# Altium schematic sheet MB_drivers.SchDoc
size 594 x 420 mm; SheetNumber: 7; SheetTotal: 8
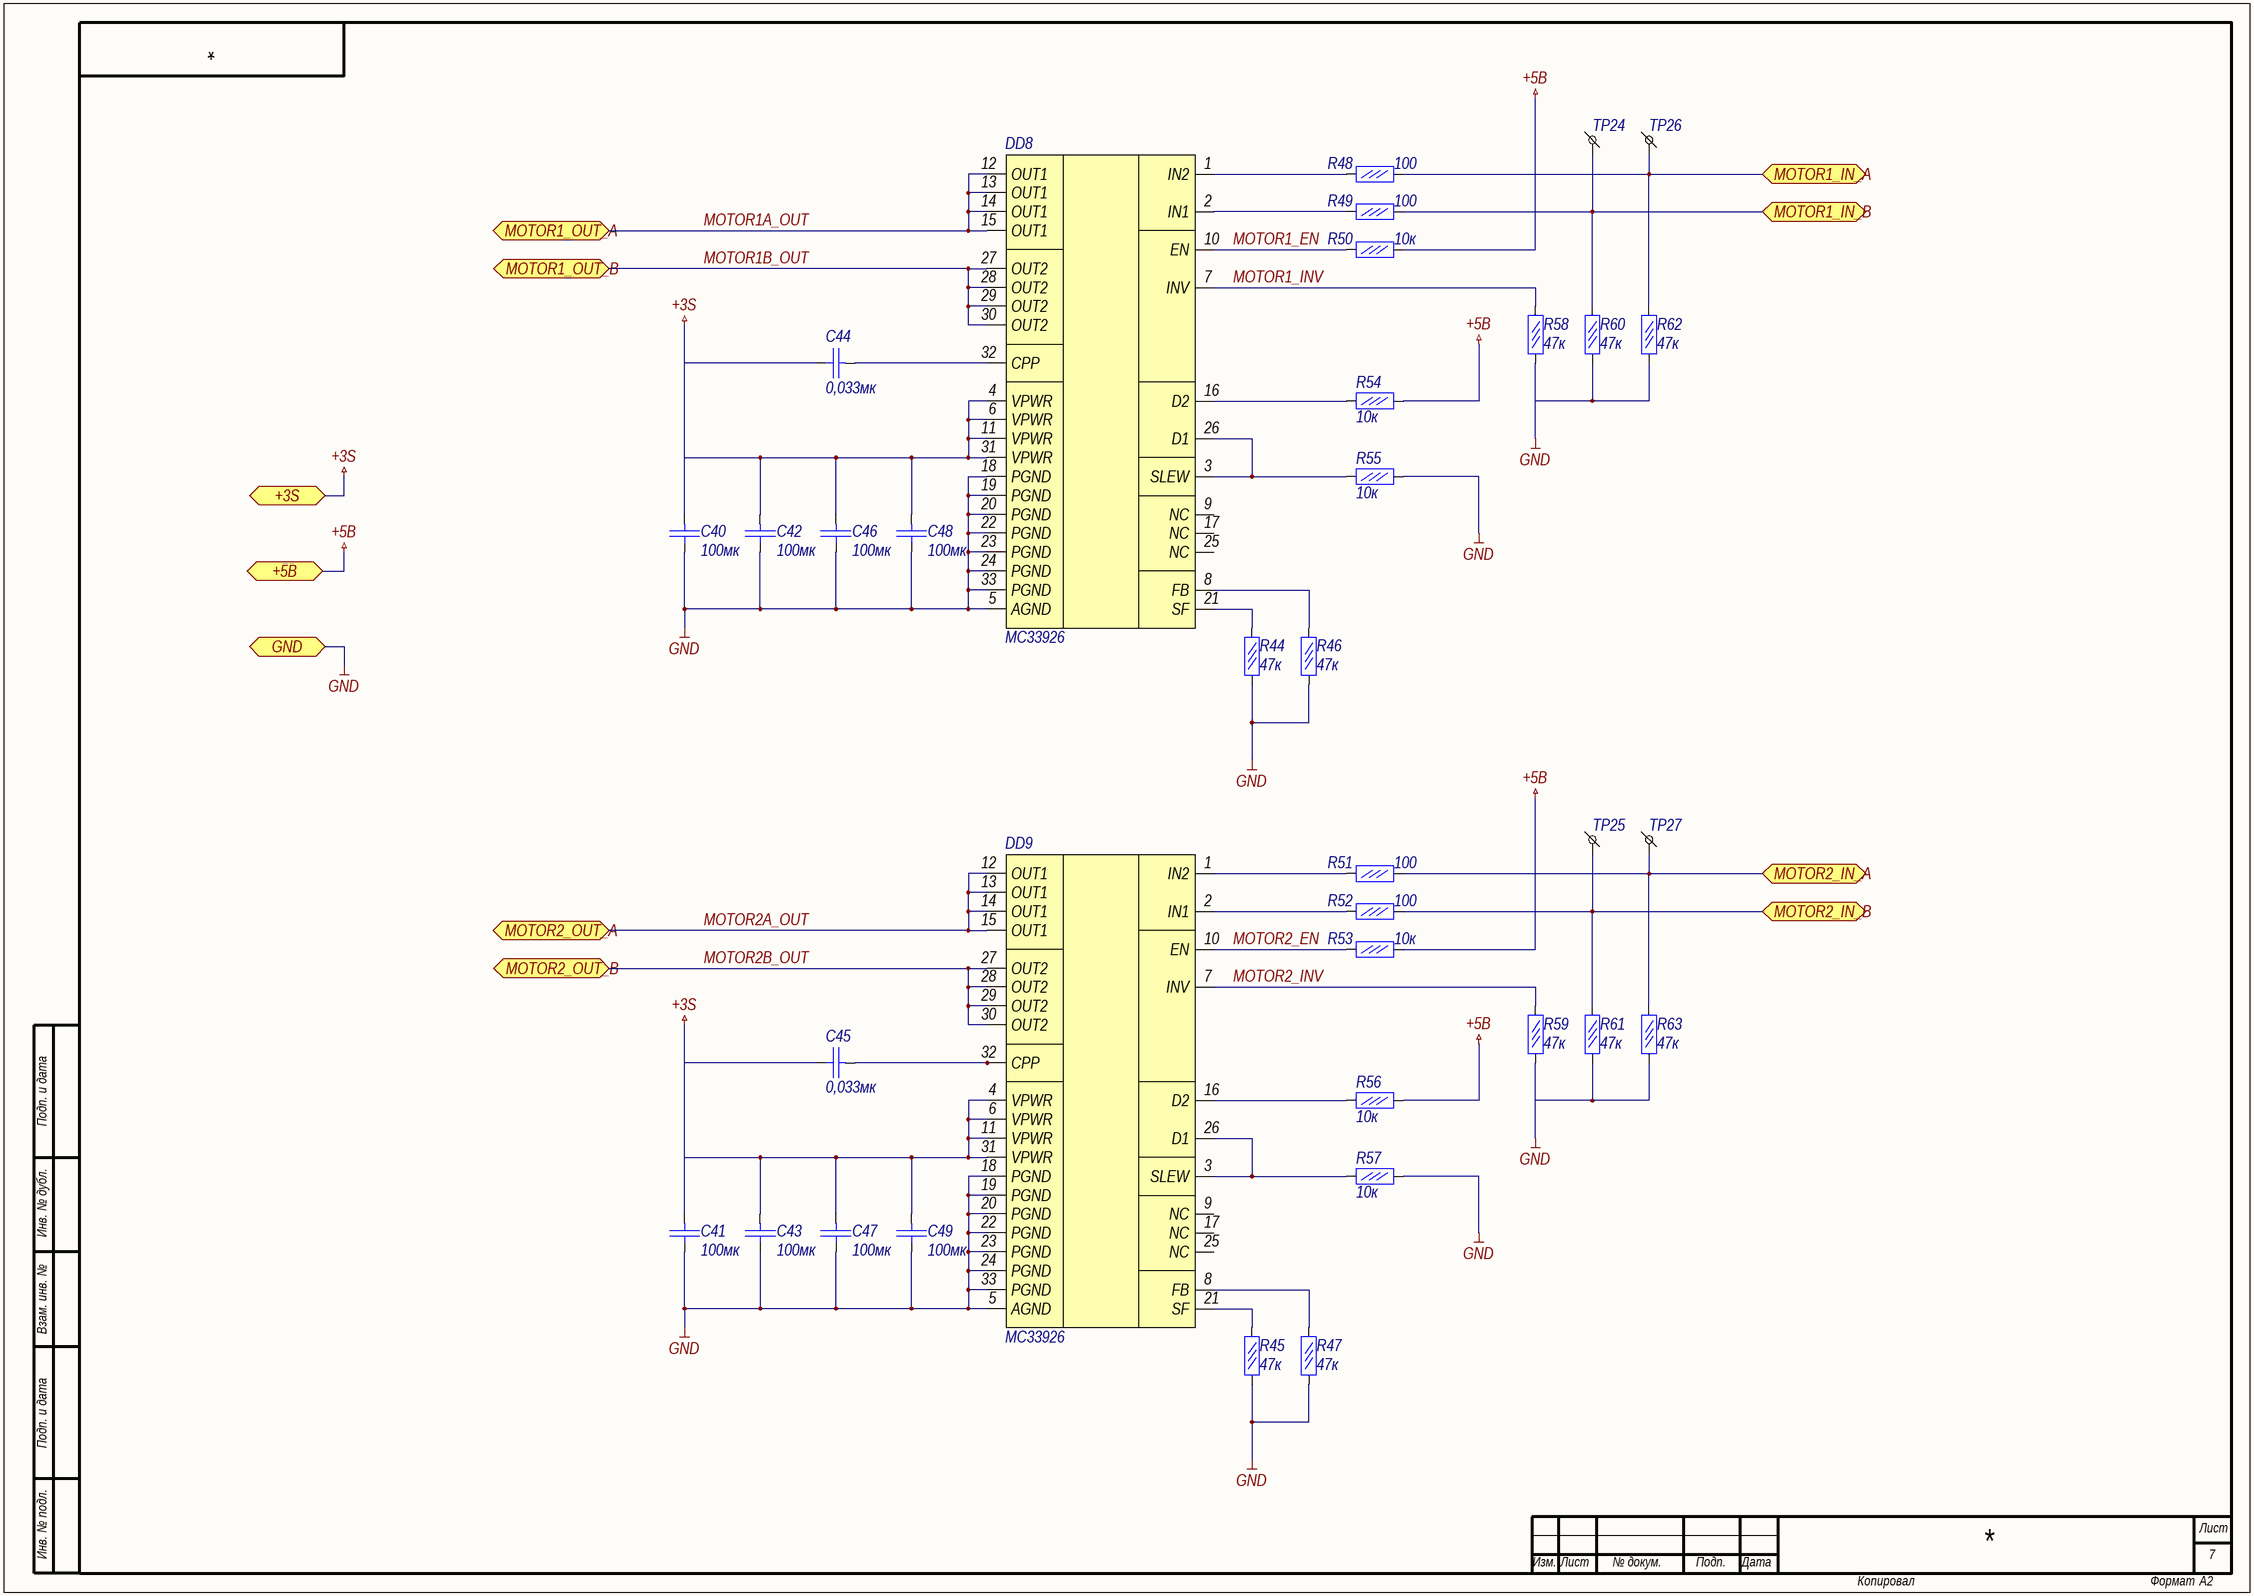
[diagram p0: MB_drivers.SchDoc]

## Parts
DD8  MС33926  [PQFN32]
DD9  MС33926  [PQFN32]
R44  47к  [R0402]
R45  47к  [R0402]
R46  47к  [R0402]
R47  47к  [R0402]
R48  100  [R0402]
R49  100  [R0402]
R50  10к  [R0402]
R51  100  [R0402]
R52  100  [R0402]
R53  10к  [R0402]
R54  10к  [R0402]
R55  10к  [R0402]
R56  10к  [R0402]
R57  10к  [R0402]
R58  47к  [R0402]
R59  47к  [R0402]
R60  47к  [R0402]
R61  47к  [R0402]
R62  47к  [R0402]
R63  47к  [R0402]
TP24  TestPoint  [0.5 x 0,9_round]  (value not drawn)
TP25  TestPoint  [0.5 x 0,9_round]  (value not drawn)
TP26  TestPoint  [0.5 x 0,9_round]  (value not drawn)
TP27  TestPoint  [0.5 x 0,9_round]  (value not drawn)
С40  100мк  [C1210_AA - 2.5]
С41  100мк  [C1210_AA - 2.5]
С42  100мк  [C1210_AA - 2.5]
С43  100мк  [C1210_AA - 2.5]
С44  0,033мк  [C0402]
С45  0,033мк  [C0402]
С46  100мк  [C1210_AA - 2.5]
С47  100мк  [C1210_AA - 2.5]
С48  100мк  [C1210_AA - 2.5]
С49  100мк  [C1210_AA - 2.5]

## Ports
+3S (bidir), +5В (bidir), GND (bidir), MOTOR1_IN_A (bidir), MOTOR1_IN_B (bidir), MOTOR1_OUT_A (bidir), MOTOR1_OUT_B (bidir), MOTOR2_IN_A (bidir), MOTOR2_IN_B (bidir), MOTOR2_OUT_A (bidir), MOTOR2_OUT_B (bidir)

## Nets
+3S: DD8.4(VPWR) DD8.6(VPWR) DD8.11(VPWR) DD8.31(VPWR) DD9.4(VPWR) DD9.6(VPWR) DD9.11(VPWR) DD9.31(VPWR) С40.2 С41.2 С42.2 С43.2 С44.1 С45.1 С46.2 С47.2 С48.2 С49.2 ; port +3S
+5В: R50.1 R53.1 R54.1 R56.1 ; port +5В
GND: DD8.5(AGND) DD8.18(PGND) DD8.19(PGND) DD8.20(PGND) DD8.22(PGND) DD8.23(PGND) DD8.24(PGND) DD8.33(PGND) DD9.5(AGND) DD9.18(PGND) DD9.19(PGND) DD9.20(PGND) DD9.22(PGND) DD9.23(PGND) DD9.24(PGND) DD9.33(PGND) R44.1 R45.1 R46.1 R47.1 R55.1 R57.1 R58.1 R59.1 R60.1 R61.1 R62.1 R63.1 С40.1 С41.1 С42.1 С43.1 С46.1 С47.1 С48.1 С49.1 ; port GND
MOTOR1_EN: DD8.10(EN) R50.2
MOTOR1_IN_A: R48.1 R62.2 TP26.1 ; port MOTOR1_IN_A
MOTOR1_IN_B: R49.1 R60.2 TP24.1 ; port MOTOR1_IN_B
MOTOR1_INV: DD8.7(INV) R58.2
MOTOR1A_OUT: DD8.12(OUT1) DD8.13(OUT1) DD8.14(OUT1) DD8.15(OUT1) ; port MOTOR1_OUT_A
MOTOR1B_OUT: DD8.27(OUT2) DD8.28(OUT2) DD8.29(OUT2) DD8.30(OUT2) ; port MOTOR1_OUT_B
MOTOR2_EN: DD9.10(EN) R53.2
MOTOR2_IN_A: R51.1 R63.2 TP27.1 ; port MOTOR2_IN_A
MOTOR2_IN_B: R52.1 R61.2 TP25.1 ; port MOTOR2_IN_B
MOTOR2_INV: DD9.7(INV) R59.2
MOTOR2A_OUT: DD9.12(OUT1) DD9.13(OUT1) DD9.14(OUT1) DD9.15(OUT1) ; port MOTOR2_OUT_A
MOTOR2B_OUT: DD9.27(OUT2) DD9.28(OUT2) DD9.29(OUT2) DD9.30(OUT2) ; port MOTOR2_OUT_B
NetDD8_1: DD8.1(IN2) R48.2
NetDD8_2: DD8.2(IN1) R49.2
NetDD8_3: DD8.3(SLEW) DD8.26(D1) R55.2
NetDD8_8: DD8.8(FB) R46.2
NetDD8_16: DD8.16(D2) R54.2
NetDD8_21: DD8.21(SF) R44.2
NetDD8_32: DD8.32(CPP) С44.2
NetDD9_1: DD9.1(IN2) R51.2
NetDD9_2: DD9.2(IN1) R52.2
NetDD9_3: DD9.3(SLEW) DD9.26(D1) R57.2
NetDD9_8: DD9.8(FB) R47.2
NetDD9_16: DD9.16(D2) R56.2
NetDD9_21: DD9.21(SF) R45.2
NetDD9_32: DD9.32(CPP) С45.2

Not connected (* = marked no-connect by the designer): DD8 9(NC) 17(NC) 25(NC); DD9 9(NC) 17(NC) 25(NC)

## Notes on the sheet
- Подп. и дата
- Инв. № дубл.
- Взам. инв. №
- Инв. № подл.
- Лист
- Изм.
- № докум.
- Подп.
- Дата
- Копировал
- Формат
- А2

## Library data of the parts
DD8 DD9 = MС33926: Драйвер мотора; Name: MС33926
R44-R63 = Резистор 0.05Вт: Резистор 0,05Вт
  R44-R47 R58-R63: Value: 47к
  R48 R49 R51 R52: Value: 100
  R50 R53-R57: Value: 10к
С40-С49 = Кер. конденсатор
  С40-С43 С46-С49: Value: 100мк
  С44 С45: Value: 0,033мк